# Altium schematic sheet 夏友.SchDoc
size A2
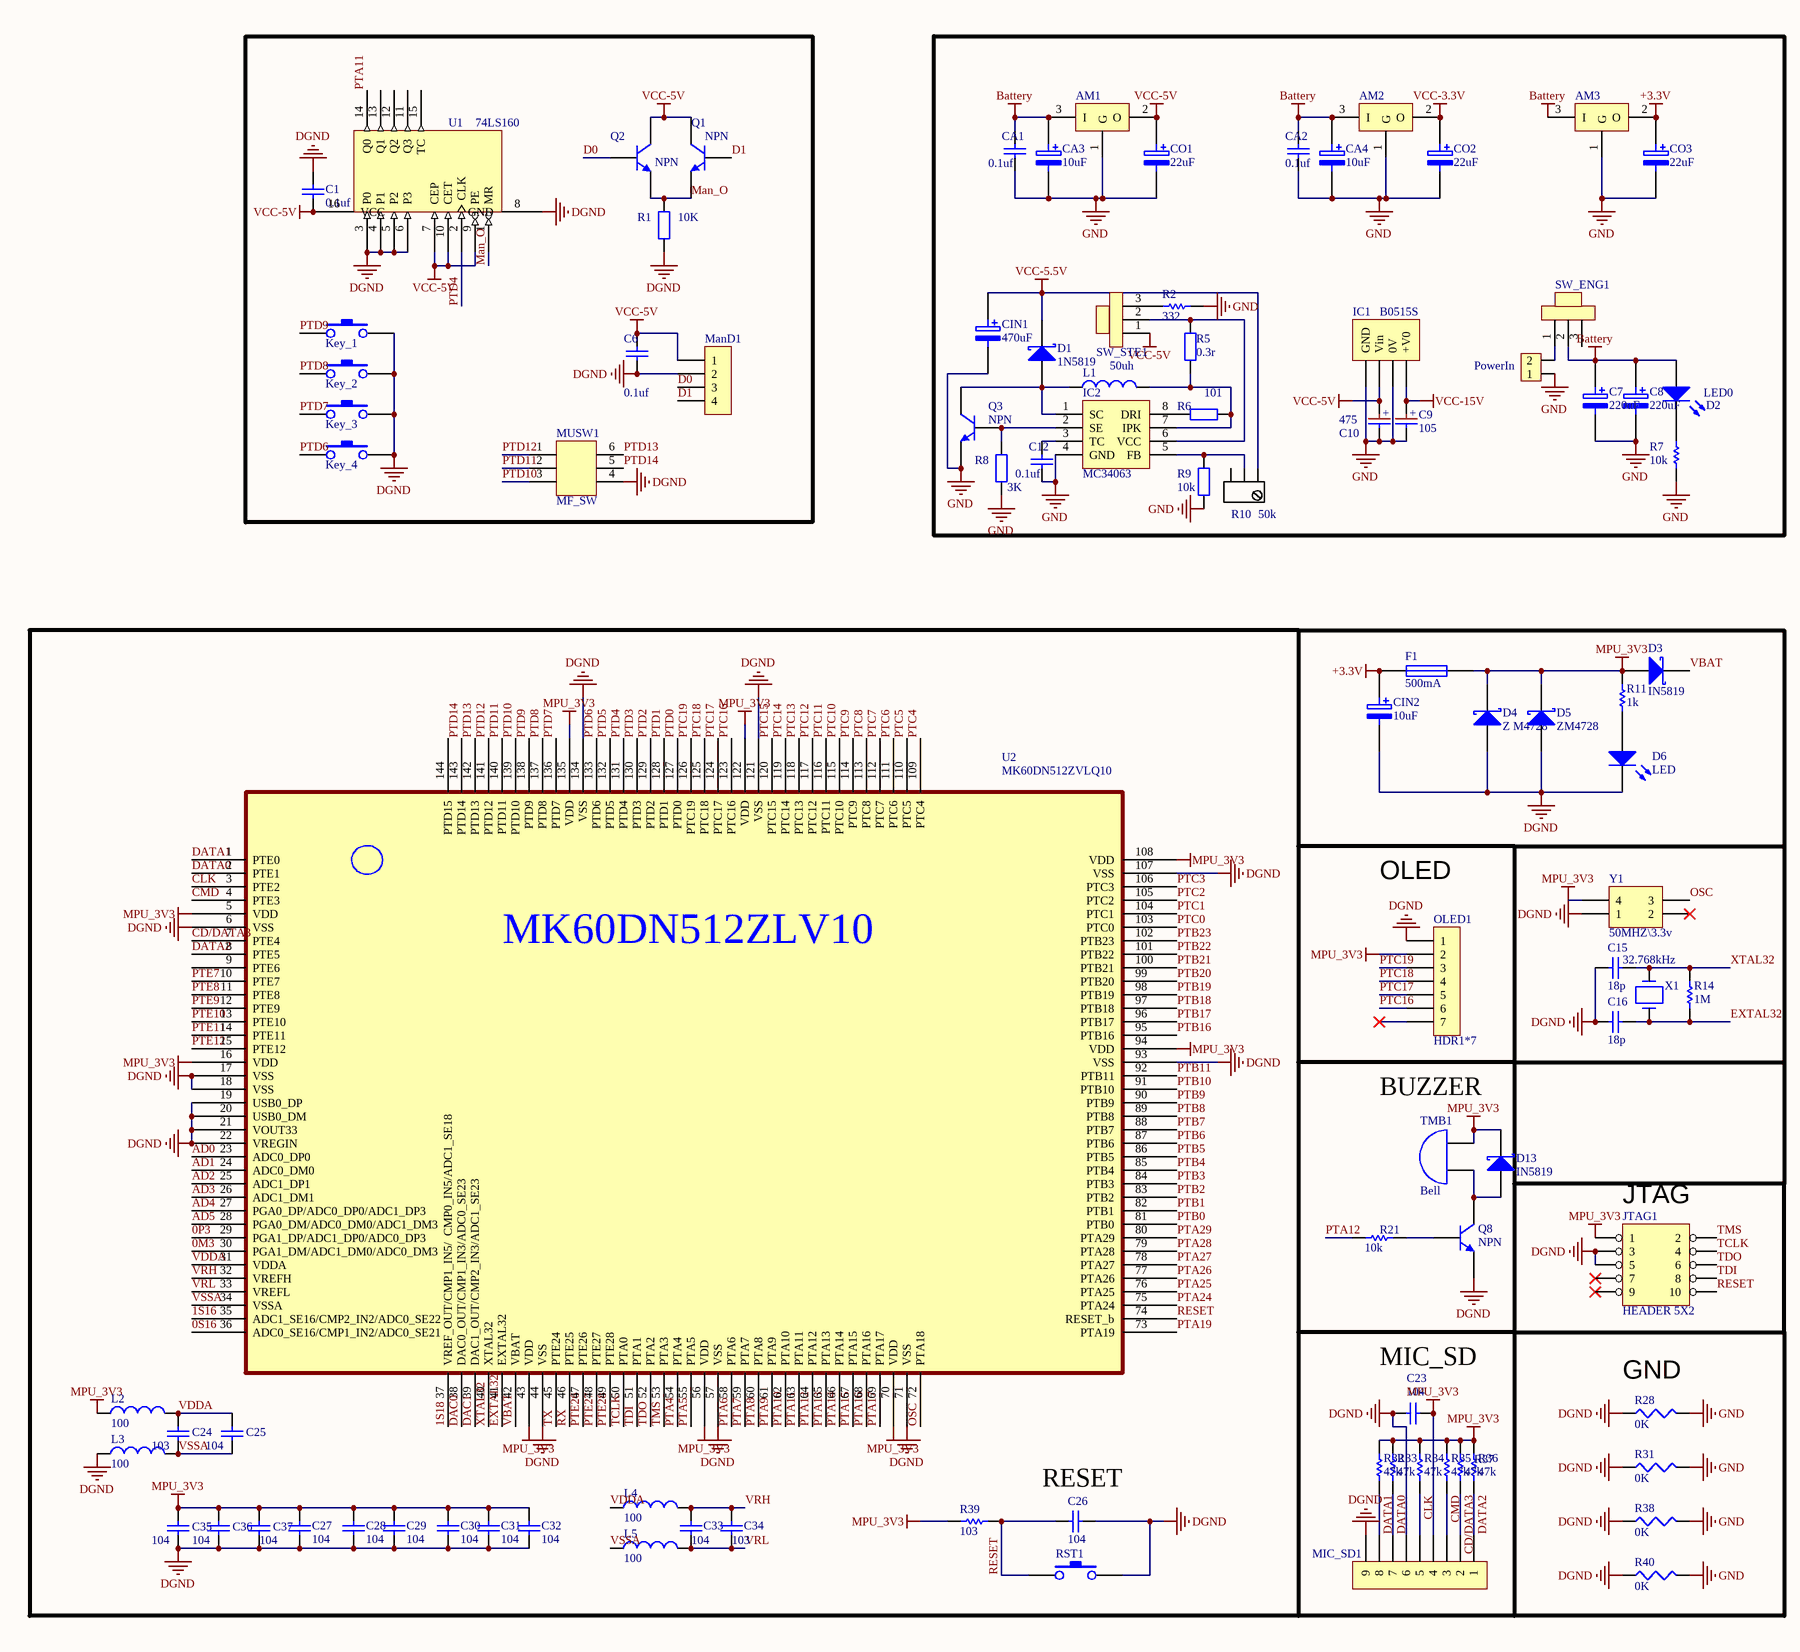
[diagram p0: 夏友.SchDoc, left]
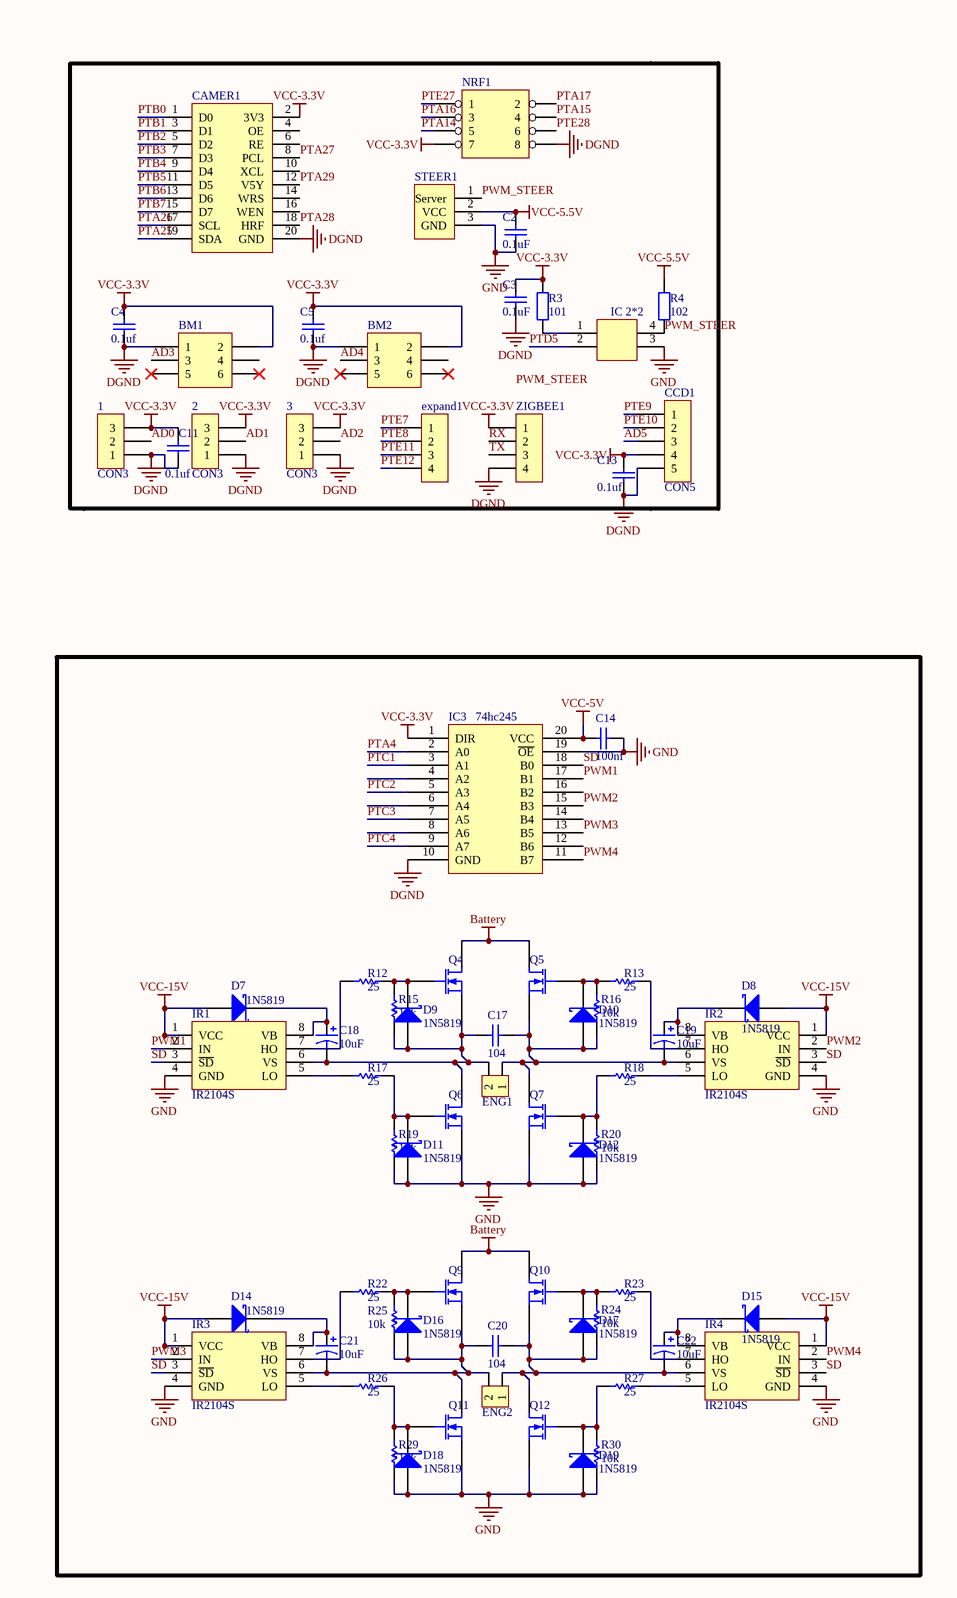
[diagram p1: 夏友.SchDoc, right]

## Parts
1  CON3  [HDR1*3]
2  CON3  [HDR1*3]
3  CON3  [HDR1*3]
*1  IC 2*2  [PC817]
AM1  AMS1117  [SOT223]  (value not drawn)
AM2  AMS1117  [SOT223]  (value not drawn)
AM3  AMS1117  [SOT223]  (value not drawn)
BM1  编码器左  [HDR2*3]  (value not drawn)
BM2  编码器左  [HDR2*3]  (value not drawn)
C1  value 0.1uf  [0603]  (hidden comment: Cap Semi)
C2  value 0.1uF  [0603]  (hidden comment: Cap)
C3  value 0.1uF  [0603]  (hidden comment: Cap)
C4  value 0.1uf  [0603]  (hidden comment: Cap Semi)
C5  value 0.1uf  [0603]  (hidden comment: Cap Semi)
C6  value 0.1uf  [0603]  (hidden comment: Cap Semi)
C7  220uF  [CAPMP7344X43N]
C8  220uF  [CAPMP7344X43N]
C9  105  [0805]
C10  475  [0805]
C11  value 0.1uf  [0603]  (hidden comment: Cap Semi)
C12  value 0.1uf  [0603]  (hidden comment: Cap Semi)
C13  value 0.1uf  [0603]  (hidden comment: Cap Semi)
C14  value 100nf  [0603]  (hidden comment: Cap Semi)
C15  value 18p  [0603]  (hidden comment: Cap Semi)
C16  value 18p  [0603]  (hidden comment: Cap Semi)
C17  value 104  [0603]  (hidden comment: Cap Semi)
C18  value 10uF  [C1206]  (hidden comment: 1uF)
C19  value 10uF  [C1206]  (hidden comment: 1uF)
C20  value 104  [0603]  (hidden comment: Cap Semi)
C21  value 10uF  [C1206]  (hidden comment: 1uF)
C22  value 10uF  [C1206]  (hidden comment: 1uF)
C23  value 104  [0603]  (hidden comment: Cap Semi)
C24  value 103  [0603]  (hidden comment: Cap Semi)
C25  value 104  [0603]  (hidden comment: Cap Semi)
C26  value 104  [0603]  (hidden comment: Cap Semi)
C27  value 104  [0603]  (hidden comment: Cap Semi)
C28  value 104  [0603]  (hidden comment: Cap Semi)
C29  value 104  [0603]  (hidden comment: Cap Semi)
C30  value 104  [0603]  (hidden comment: Cap Semi)
C31  value 104  [0603]  (hidden comment: Cap Semi)
C32  value 104  [0603]  (hidden comment: Cap Semi)
C33  value 104  [0603]  (hidden comment: Cap Semi)
C34  value 103  [0603]  (hidden comment: Cap Semi)
C35  value 104  [0603]  (hidden comment: Cap Semi)
C36  value 104  [0603]  (hidden comment: Cap Semi)
C37  value 104  [0603]  (hidden comment: Cap Semi)
CA1  value 0.1uf  [0603]  (hidden comment: Cap Semi)
CA2  value 0.1uf  [0603]  (hidden comment: Cap Semi)
CA3  10uF  [C1206]
CA4  10uF  [C1206]
CAMER1  CAMER  [HDR2*10-10*25]  (value not drawn)
CCD1  CON5  [HDR1*5]
CIN1  470uF  [470uf-column]
CIN2  10uF  [C1206]
CO1  22uF  [C1206]
CO2  22uF  [C1206]
CO3  22uF  [C1206]
CON1  PowerIn  [Battery]
D1  1N5819  [SS14]
D2  LED0  [0805]
D3  IN5819  [SS14]
D4  Z M4728  [LL41]
D5  ZM4728  [LL41]
D6  LED  [0805]
D7  1N5819  [SS14]
D8  1N5819  [SS14]
D9  1N5819  [SS14]
D10  1N5819  [SS14]
D11  1N5819  [SS14]
D12  1N5819  [SS14]
D13  IN5819  [SS14]
D14  1N5819  [SS14]
D15  1N5819  [SS14]
D16  1N5819  [SS14]
D17  1N5819  [SS14]
D18  1N5819  [SS14]
D19  1N5819  [SS14]
ENG1  PowerIn  [Dynamo]  (value not drawn)
ENG2  PowerIn  [Dynamo]  (value not drawn)
expand1  CON4  [HDR1*4]  (value not drawn)
F1  500mA  [1206]
IC1  B0515S  [B0512S]
IC2  MC34063  [SO-8]
IC3  74hc245  [74HC245D]
IR1  IR2104S  [SO-8]
IR2  IR2104S  [SO-8]
IR3  IR2104S  [SO-8]
IR4  IR2104S  [SO-8]
JTAG1  HEADER 5X2  [HDR2*5]
Key_1  按钮开关  [KEY-2]  (value not drawn)
Key_2  按钮开关  [KEY-2]  (value not drawn)
Key_3  按钮开关  [KEY-2]  (value not drawn)
Key_4  按钮开关  [KEY-2]  (value not drawn)
L1  value 50uh  [INDUCTOR 12*12*7]  (hidden comment: Inductor)
L2  value 100  [0805]  (hidden comment: Inductor)
L3  value 100  [0805]  (hidden comment: Inductor)
L4  value 100  [0805]  (hidden comment: Inductor)
L5  value 100  [0805]  (hidden comment: Inductor)
ManD1  HDR1*4  [HDR1*4]  (value not drawn)
MIC_SD1  ON9  [TF-2]  (value not drawn)
MUSW1  MF_SW  [MUL_SW]
NRF1  HEADER 4X2  [HDR2*4]  (value not drawn)
OLED1  HDR1*7  [HDR1*7]
Q1  NPN  [SOT95P280X125-3N]
Q2  NPN  [SOT95P280X125-3N]
Q3  NPN  [SOT95P280X125-3N]
Q4  MOSFET-N  [LR7843]  (value not drawn)
Q5  MOSFET-N  [LR7843]  (value not drawn)
Q6  MOSFET-N  [LR7843]  (value not drawn)
Q7  MOSFET-N  [LR7843]  (value not drawn)
Q8  NPN  [SOT95P280X125-3N]
Q9  MOSFET-N  [LR7843]  (value not drawn)
Q10  MOSFET-N  [LR7843]  (value not drawn)
Q11  MOSFET-N  [LR7843]  (value not drawn)
Q12  MOSFET-N  [LR7843]  (value not drawn)
R1  value 10K  [0603]  (hidden comment: Res2)
R2  332  [0805]
R3  value 101  [0603]  (hidden comment: Res2)
R4  value 102  [0603]  (hidden comment: Res2)
R5  value 0.3r  [0603]  (hidden comment: Res2)
R6  value 101  [0603]  (hidden comment: Res2)
R7  10k  [0805]
R8  value 3K  [0603]  (hidden comment: Res2)
R9  value 10k  [0603]  (hidden comment: Res2)
R10  50k  [HDR1*3]
R11  1k  [0805]
R12  value 25  [0603]  (hidden comment: Res1)
R13  value 25  [0603]  (hidden comment: Res1)
R14  1M  [0603]
R15  value 10k  [0805]  (hidden comment: Res1)
R16  value 10k  [0805]  (hidden comment: Res1)
R17  value 25  [0603]  (hidden comment: Res1)
R18  value 25  [0603]  (hidden comment: Res1)
R19  value 10k  [0805]  (hidden comment: Res1)
R20  value 10k  [0805]  (hidden comment: Res1)
R21  10k  [0603]
R22  value 25  [0603]  (hidden comment: Res1)
R23  value 25  [0603]  (hidden comment: Res1)
R24  value 10k  [0805]  (hidden comment: Res1)
R25  value 10k  [0805]  (hidden comment: Res1)
R26  value 25  [0603]  (hidden comment: Res1)
R27  value 25  [0603]  (hidden comment: Res1)
R28  value 0K  [0805]  (hidden comment: Res3)
R29  value 10k  [0805]  (hidden comment: Res1)
R30  value 10k  [0805]  (hidden comment: Res1)
R31  value 0K  [0805]  (hidden comment: Res3)
R32  47k  [0603]
R33  47k  [0603]
R34  47k  [0603]
R35  47k  [0603]
R36  47k  [0603]
R37  47k  [0603]
R38  value 0K  [0805]  (hidden comment: Res3)
R39  103  [0805]
R40  value 0K  [0805]  (hidden comment: Res3)
RST1  按钮开关  [KEY-2]  (value not drawn)
STEER1  Header_Server  [HDR1X3]  (value not drawn)
SW_ENG1  SWITCH_B  [ss12]  (value not drawn)
SW_STE1  SWITCH_B  [ss12]  (value not drawn)
TMB1  Bell  [DIP_buzzer]
U1  74LS160  [SOIC-16]
U2  MK60DN512ZVLQ10  [MK60DN512ZVLQ10]
X1  32.768kHz  [XT 32768]
Y1  50MHZ\3.3v  [有源晶振5*3.2]
ZIGBEE1  CON4  [HDR1*4]  (value not drawn)

## Nets
+3.3V: AM3.2(O) CIN2.1 CO3.1 F1.1
Battery: AM1.3(I) AM2.3(I) AM3.3(I) C7.1 C8.1 CA1.1 CA2.1 CA3.1 CA4.1 D2.1(A) Q4.1(D) Q5.1(D) Q9.1(D) Q10.1(D) SW_ENG1.2
DGND: 1.1 2.1 3.1 *1.3 AM1.1(G) AM2.1(G) AM3.1(G) BM1.1 BM2.1 C1.2 C2.1 C3.1 C4.2 C5.2 C6.2 C7.2 C8.2 C9.2 C10.2 C11.1 C12.2 C13.1 C14.2 C15.2 C16.2 C23.2 C26.1 C27.1 C28.2 C29.1 C30.2 C31.2 C32.2 C35.1 C36.1 C37.2 CA1.2 CA2.2 CA3.2 CA4.2 CAMER1.20(GND) CCD1.5 CIN1.2 CIN2.2 CO1.2 CO2.2 CO3.2 CON1.1 D4.1(A) D5.1(A) D6.2(K) D11.1(A) D12.1(A) D18.1(A) D19.1(A) IC1.1(GND) IC1.3(0V) IC2.4(GND) IC3.10(GND) IC3.19(~{OE}) IR1.4(GND) IR2.4(GND) IR3.4(GND) IR4.4(GND) JTAG1.3 JTAG1.5 Key_1.2 Key_2.2 Key_3.2 Key_4.2 L3.1 ManD1.2 MIC_SD1.6 MIC_SD1.9 MUSW1.4 NRF1.8 OLED1.1 Q3.3(E) Q6.3(S) Q7.3(S) Q8.3(E) Q11.3(S) Q12.3(S) R1.1 R2.2 R7.2 R8.1 R9.2 R19.2 R20.2 R28.1 R28.2 R29.2 R30.2 R31.1 R31.2 R38.1 R38.2 R40.1 R40.2 RST1.2 STEER1.3(GND) U1.3(P0) U1.4(P1) U1.5(P2) U1.6(P3) U1.8(GND) U2.6(VSS) U2.17(VSS) U2.18(VSS) U2.19(USB0_DP) U2.20(USB0_DM) U2.21(VOUT33) U2.22(VREGIN) U2.44(VSS) U2.57(VSS) U2.71(VSS) U2.93(VSS) U2.107(VSS) U2.121(VSS) U2.134(VSS) Y1.1 ZIGBEE1.4  [also labelled GND]
MPU_3V3: C23.1 C27.2 C28.1 C29.2 C30.1 C31.1 C32.1 C35.2 C36.2 C37.1 D3.1(A) D4.2(K) D5.2(K) D13.2(K) F1.2 JTAG1.1 L2.1 MIC_SD1.4 OLED1.2 R11.1 R32.1 R33.1 R34.1 R35.1 R36.1 R37.1 R39.2 TMB1.1(A) U2.5(VDD) U2.16(VDD) U2.43(VDD) U2.56(VDD) U2.70(VDD) U2.94(VDD) U2.108(VDD) U2.122(VDD) U2.135(VDD) Y1.4
VCC: AM1.2(O) C1.1 C6.1 C10.1 C14.1 CO1.1 IC1.2(Vin) IC3.20(VCC) ManD1.1 Q1.1(C) Q2.1(C) SW_STE1.1 U1.7(CEP) U1.9(PE) U1.10(CET) U1.16(VCC)  [also labelled VCC-5V]
VCC-3.3V: 1.3 2.3 3.3 AM2.2(O) BM1.2 BM2.2 C3.2 C4.1 C5.1 C11.2 C13.2 CAMER1.2(3V3) CCD1.4 CO2.1 IC3.1(DIR) NRF1.7 R3.2 ZIGBEE1.1
VCC-5.5V: C2.2 CIN1.1 D1.2(K) R4.2 R10.1 STEER1.2(VCC)
VCC-15V: C9.1 D7.1(A) D8.1(A) D14.1(A) D15.1(A) IC1.4(+V0) IR1.1(VCC) IR2.1(VCC) IR3.1(VCC) IR4.1(VCC)
0M3: U2.30(PGA1_DM/ADC1_DM0/ADC0_DM3)
0P3: U2.29(PGA1_DP/ADC1_DP0/ADC0_DP3)
0S16: U2.36(ADC0_SE16/CMP1_IN2/ADC0_SE21)
1S16: U2.35(ADC1_SE16/CMP2_IN2/ADC0_SE22)
1S18: U2.37(VREF_OUT/CMP1_IN5/__CMP0_IN5/ADC1_SE18)
AD0: 1.2 U2.23(ADC0_DP0)
AD1: 2.2 U2.24(ADC0_DM0)
AD2: 3.2 U2.25(ADC1_DP1)
AD3: BM1.3 U2.26(ADC1_DM1)
AD4: BM2.3 U2.27(PGA0_DP/ADC0_DP0/ADC1_DP3)
AD5: CCD1.3 U2.28(PGA0_DM/ADC0_DM0/ADC1_DM3)
CD/DATA3: MIC_SD1.2 R37.2 U2.7(PTE4)
CLK: MIC_SD1.5 R34.2 U2.3(PTE2)
CMD: MIC_SD1.3 R35.2 U2.4(PTE3)
D0: ManD1.3 Q2.2(B)
D1: ManD1.4 Q1.2(B)
DAC0: U2.38(DAC0_OUT/CMP1_IN3/ADC0_SE23)
DAC1: U2.39(DAC1_OUT/CMP2_IN3/ADC1_SE23)
DATA0: MIC_SD1.7 R33.2 U2.2(PTE1)
DATA1: MIC_SD1.8 R32.2 U2.1(PTE0)
DATA2: MIC_SD1.1 R36.2 U2.8(PTE5)
EXTAL32: C16.1 R14.2 U2.41(EXTAL32) X1.2
Man_O: Q1.3(E) Q2.3(E) R1.2 U1.1(MR)
OSC: U2.72(PTA18) Y1.3
PTA4: IC3.2(A0) U2.54(PTA4)
PTA5: U2.55(PTA5)
PTA6: U2.58(PTA6)
PTA7: U2.59(PTA7)
PTA8: U2.60(PTA8)
PTA9: U2.61(PTA9)
PTA10: U2.62(PTA10)
PTA11: U1.14(Q0) U2.63(PTA11)
PTA12: R21.1 U2.64(PTA12)
PTA13: U2.65(PTA13)
PTA14: NRF1.5 U2.66(PTA14)
PTA15: NRF1.4 U2.67(PTA15)
PTA16: NRF1.3 U2.68(PTA16)
PTA17: NRF1.2 U2.69(PTA17)
PTA19: U2.73(PTA19)
PTA24: U2.75(PTA24)
PTA25: CAMER1.19(SDA) U2.76(PTA25)
PTA26: CAMER1.17(SCL) U2.77(PTA26)
PTA27: CAMER1.8(PCL) U2.78(PTA27)
PTA28: CAMER1.18(HRF) U2.79(PTA28)
PTA29: CAMER1.12(V5Y) U2.80(PTA29)
PTB0: CAMER1.1(D0) U2.81(PTB0)
PTB1: CAMER1.3(D1) U2.82(PTB1)
PTB2: CAMER1.5(D2) U2.83(PTB2)
PTB3: CAMER1.7(D3) U2.84(PTB3)
PTB4: CAMER1.9(D4) U2.85(PTB4)
PTB5: CAMER1.11(D5) U2.86(PTB5)
PTB6: CAMER1.13(D6) U2.87(PTB6)
PTB7: CAMER1.15(D7) U2.88(PTB7)
PTB8: U2.89(PTB8)
PTB9: U2.90(PTB9)
PTB10: U2.91(PTB10)
PTB11: U2.92(PTB11)
PTB16: U2.95(PTB16)
PTB17: U2.96(PTB17)
PTB18: U2.97(PTB18)
PTB19: U2.98(PTB19)
PTB20: U2.99(PTB20)
PTB21: U2.100(PTB21)
PTB22: U2.101(PTB22)
PTB23: U2.102(PTB23)
PTC0: U2.103(PTC0)
PTC1: IC3.3(A1) U2.104(PTC1)
PTC2: IC3.5(A3) U2.105(PTC2)
PTC3: IC3.7(A5) U2.106(PTC3)
PTC4: IC3.9(A7) U2.109(PTC4)
PTC5: U2.110(PTC5)
PTC6: U2.111(PTC6)
PTC7: U2.112(PTC7)
PTC8: U2.113(PTC8)
PTC9: U2.114(PTC9)
PTC10: U2.115(PTC10)
PTC11: U2.116(PTC11)
PTC12: U2.117(PTC12)
PTC13: U2.118(PTC13)
PTC14: U2.119(PTC14)
PTC15: U2.120(PTC15)
PTC16: OLED1.6 U2.123(PTC16)
PTC17: OLED1.5 U2.124(PTC17)
PTC18: OLED1.4 U2.125(PTC18)
PTC19: OLED1.3 U2.126(PTC19)
PTD0: U2.127(PTD0)
PTD1: U2.128(PTD1)
PTD2: U2.129(PTD2)
PTD3: U2.130(PTD3)
PTD4: U1.2(CLK) U2.131(PTD4)
PTD5: *1.2 U2.132(PTD5)
PTD6: Key_4.1 U2.133(PTD6)
PTD7: Key_3.1 U2.136(PTD7)
PTD8: Key_2.1 U2.137(PTD8)
PTD9: Key_1.1 U2.138(PTD9)
PTD10: MUSW1.3 U2.139(PTD10)
PTD11: MUSW1.2 U2.140(PTD11)
PTD12: MUSW1.1 U2.141(PTD12)
PTD13: MUSW1.6 U2.142(PTD13)
PTD14: MUSW1.5 U2.143(PTD14)
PTE7: expand1.1 U2.10(PTE7)
PTE8: expand1.2 U2.11(PTE8)
PTE9: CCD1.1 U2.12(PTE9)
PTE10: CCD1.2 U2.13(PTE10)
PTE11: expand1.3 U2.14(PTE11)
PTE12: expand1.4 U2.15(PTE12)
PTE26: U2.47(PTE26)
PTE27: NRF1.1 U2.48(PTE27)
PTE28: NRF1.6 U2.49(PTE28)
PWM1: IC3.17(B1) IR1.2(IN)
PWM2: IC3.15(B3) IR2.2(IN)
PWM3: IC3.13(B5) IR3.2(IN)
PWM4: IC3.11(B7) IR4.2(IN)
PWM_STEER: *1.4 R4.1 STEER1.1(Server)
RESET: C26.2 JTAG1.10 R39.1 RST1.1 U2.74(RESET_b)
RX: U2.46(PTE25) ZIGBEE1.2
SD: IC3.18(B0) IR1.3(~{SD}) IR2.3(~{SD}) IR3.3(~{SD}) IR4.3(~{SD})
TCLK: JTAG1.4 U2.50(PTA0)
TDI: JTAG1.8 U2.51(PTA1)
TDO: JTAG1.6 U2.52(PTA2)
TMS: JTAG1.2 U2.53(PTA3)
TX: U2.45(PTE24) ZIGBEE1.3
VBAT: D3.2(K) U2.42(VBAT)
VDDA: C24.2 C25.2 L2.2 L4.1 U2.31(VDDA)
VRH: C33.1 C34.2 L4.2 U2.32(VREFH)
VRL: C33.2 C34.1 L5.2 U2.33(VREFL)
VSSA: C24.1 C25.1 L3.2 L5.1 U2.34(VSSA)
XTAL32: C15.1 R14.1 U2.40(XTAL32) X1.1
Net*1_1: *1.1 R3.1
NetC12_1: C12.1 IC2.3(TC)
NetC17_1: C17.1 C19.2 D10.1(A) ENG1.1 IR2.6(VS) Q5.3(S) Q7.1(D) R16.2
NetC17_2: C17.2 C18.2 D9.1(A) ENG1.2 IR1.6(VS) Q4.3(S) Q6.1(D) R15.2
NetC18_1: C18.1 D7.2(K) IR1.8(VB)
NetC19_1: C19.1 D8.2(K) IR2.8(VB)
NetC20_1: C20.1 C22.2 D17.1(A) ENG2.1 IR4.6(VS) Q10.3(S) Q12.1(D) R24.2
NetC20_2: C20.2 C21.2 D16.1(A) ENG2.2 IR3.6(VS) Q9.3(S) Q11.1(D) R25.2
NetC21_1: C21.1 D14.2(K) IR3.8(VB)
NetC22_1: C22.1 D15.2(K) IR4.8(VB)
NetCON1_2: CON1.2 SW_ENG1.1
NetD1_1: D1.1(A) IC2.1(SC) L1.1 Q3.1(C)
NetD2_2: D2.2(K) R7.1
NetD6_1: D6.1(A) R11.2
NetD9_2: D9.2(K) Q4.2(G) R12.1 R15.1
NetD10_2: D10.2(K) Q5.2(G) R13.2 R16.1
NetD11_2: D11.2(K) Q6.2(G) R17.1 R19.1
NetD12_2: D12.2(K) Q7.2(G) R18.2 R20.1
NetD13_1: D13.1(A) Q8.1(C) TMB1.2(B)
NetD16_2: D16.2(K) Q9.2(G) R22.1 R25.1
NetD17_2: D17.2(K) Q10.2(G) R23.2 R24.1
NetD18_2: D18.2(K) Q11.2(G) R26.1 R29.1
NetD19_2: D19.2(K) Q12.2(G) R27.2 R30.1
NetIC2_2: IC2.2(SE) Q3.2(B) R8.2
NetIC2_5: IC2.5(FB) R9.1 R10.2
NetIC2_6: IC2.6(VCC) R5.2 SW_STE1.2
NetIC2_7: IC2.7(IPK) L1.2 R5.1 R6.1
NetIC2_8: IC2.8(DRI) R6.2
NetIR1_5: IR1.5(LO) R17.2
NetIR1_7: IR1.7(HO) R12.2
NetIR2_5: IR2.5(LO) R18.1
NetIR2_7: IR2.7(HO) R13.1
NetIR3_5: IR3.5(LO) R26.2
NetIR3_7: IR3.7(HO) R22.2
NetIR4_5: IR4.5(LO) R27.1
NetIR4_7: IR4.7(HO) R23.1
NetQ8_2: Q8.2(B) R21.2
NetR2_1: R2.1 SW_STE1.3

Not connected (* = marked no-connect by the designer): BM1 4 5* 6*; BM2 4 5* 6*; CAMER1 4(OE) 6(RE) 10(XCL) 14(WRS) 16(WEN); IC3 4(A2) 6(A4) 8(A6) 12(B6) 14(B4) 16(B2); JTAG1 7* 9*; OLED1 7*; R10 3(2); SW_ENG1 3; U1 11(Q3) 12(Q2) 13(Q1) 15(TC); U2 9(PTE6) 144(PTD15); Y1 2*

## Notes on the sheet
- MPU
- OLED
- BUZZER
- (near JTAG1) JTAG
- (near C23) MIC_SD
- (near R28) GND
- (near C26) RESET
- Labels drawn without touching a wire or pin: PWM_STEER
- (in symbol Cap--0805) +
- (in symbol MK60DN512ZVLQ10) MK60DN512ZLV10

## Library data of the parts
1-3 = CON3: Connector
BM1 BM2 = Header 3X2: Header, 3-Pin, Dual row; LatestRevisionDate: 17-Jul-2002; LatestRevisionNote: Re-released for DXP Platform.; Publisher: Altium Limited
C1 C4-C6 C11-C17 C20 C23-C37 CA1 CA2 = Cap Semi_1: Capacitor (Semiconductor SIM Model); Published: 8-Jun-2000; LatestRevisionDate: 17-Jul-2002; LatestRevisionNote: Re-released for DXP Platform.; PackageReference: C1206; Publisher: Altium Limited
C2 C3 = Cap: Capacitor; Published: 8-Jun-2000; LatestRevisionDate: 17-Jul-2002; LatestRevisionNote: Re-released for DXP Platform.; PackageReference: RAD-0.3; Publisher: Altium Limited
C7 C8 CA3 CA4 CIN1 CIN2 CO1-CO3 = ELECTRO2: Electrolytic Capacitor
C9 C10 = Cap--0805: 电容器
C18 C19 C21 C22 = Cap Pol1: Polarized Capacitor (Radial); Published: 8-Jun-2000; LatestRevisionDate: 17-Jul-2002; LatestRevisionNote: Re-released for DXP Platform.; PackageReference: RB7.6-15; Publisher: Altium Limited
CCD1 = CON5: Connector
CON1 ENG1 ENG2 = Header 2: Header, 2-Pin
D1 D7-D12 D14-D19 = Diode 11DQ03: Schottky Rectifier; Published: 8-Jun-2000; LatestRevisionDate: 17-Jul-2002; LatestRevisionNote: Re-released for DXP Platform.; DatasheetVersion: Dec-1997; PackageReference: DO-204AL; Publisher: Altium Limited; Code_JEDEC: DO-204-AL; ComponentLink1Description: Manufacturer Link; ComponentLink1URL: http://www.irf.com/; ComponentLink2Description: Datasheet; ComponentLink2URL: http://www.irf.com/product-info/datasheets/data/11dq03.pdf
D2 = LED0: Typical INFRARED GaAs LED; Published: 8-Jun-2000; LatestRevisionDate: 08-Jul-2005; LatestRevisionNote: Mech Layer 1 removed.; PackageReference: LED-0; Publisher: Altium Limited; PackageDescription: LED; 2 Leads
D3-D5 D13 = D Schottky: Schottky Diode; Published: 8-Jun-2000; LatestRevisionDate: 17-Jul-2002; LatestRevisionNote: Re-released for DXP Platform.; PackageReference: SMB; Publisher: Altium Limited; Code_JEDEC: DO-214-AA
  D13: PackageDescription: DO-214-AA/SMB; 2 C-Bend Leads; Body 5.3 x 3.6 mm, inc. leads (LxW)
D6 = LED: 发光二极管
expand1 ZIGBEE1 = CON4: Connector
F1 = FUSE
IC1 = B0512S-1W
IC3 = 74lvc245: 8位5伏转3.3伏电平转换芯片
IR1-IR4 = IR2104S: HALF-BRIDGE DRIVER
L1-L5 = Inductor: Code_IEC: 1005; Published: 8-Jun-2000; LatestRevisionDate: 17-Jul-2002; LatestRevisionNote: Re-released for DXP Platform.; PackageReference: 0402-A; Publisher: Altium Limited; Code_JEITA: 0402
MIC_SD1 = CON9: Connector
Q1-Q3 Q8 = QNPN: NPN Bipolar Transistor; Published: 8-Jun-2000; LatestRevisionDate: 29-May-2009; LatestRevisionNote: IPC-7351 Footprint Added.; PackageVersion: Aug-1999; PackageReference: SOT-23B; Publisher: Altium Limited; PackageDescription: 3-Pin SOT-23 Package 0.95 mm Pitch, 2.4 mm Lead Span
Q4-Q7 Q9-Q12 = MOSFET-N: N-Channel MOSFET; Published: 8-Jun-2000; LatestRevisionDate: 17-Jul-2002; LatestRevisionNote: Re-released for DXP Platform.; PackageVersion: 1995/1996; PackageReference: E3; Publisher: Altium Limited; PackageDescription: TO, Flat Index; 3 In-Line, Axial Leads; Body Dia. 4.6mm; Lead Dia. 0.5 mm (max)
R1 R3-R6 R8 R9 = Res2: Resistor; Published: 8-Jun-2000; LatestRevisionDate: 17-Jul-2002; LatestRevisionNote: Re-released for DXP Platform.; PackageReference: AXIAL-0.4; Publisher: Altium Limited; PackageDescription: Axial Device, Thru-Hole; 2 Leads; 0.4 in Pin Spacing
R2 R7 R11 R14 R21 R32-R37 R39 = Res: 电阻
R10 = 精密电位器
R12 R13 R15-R20 R22-R27 R29 R30 = Res1: Resistor; Published: 8-Jun-2000; LatestRevisionDate: 17-Jul-2002; LatestRevisionNote: Re-released for DXP Platform.; PackageReference: AXIAL-0.3; Publisher: Altium Limited
R28 R31 R38 R40 = Res3: Resistor; Published: 8-Jun-2000; LatestRevisionDate: 29-May-2009; LatestRevisionNote: IPC-7351 Footprint Added.; PackageReference: J1-0603; Publisher: Altium Limited; PackageDescription: Chip Resistor
TMB1 = Bell: Electrical Bell; Published: 24-Mar-1999; LatestRevisionDate: 17-Jul-2002; LatestRevisionNote: Re-released for DXP Platform.; PackageReference: PIN2; Publisher: Altium Limited
U1 = 74ALS161
U2 = MK60DN512ZVLQ10: K60
X1 = CRYSTAL_1: Text Field1: 20; Text Field2: 20